# Altium schematic sheet sensorBoard.SchDoc: Valkyrie
size 508 x 381 mm; DrawnBy: Pedro Fernandes; Address1: Sensor Board; Address2: NFS Fenix; SheetNumber: 1; SheetTotal: 1
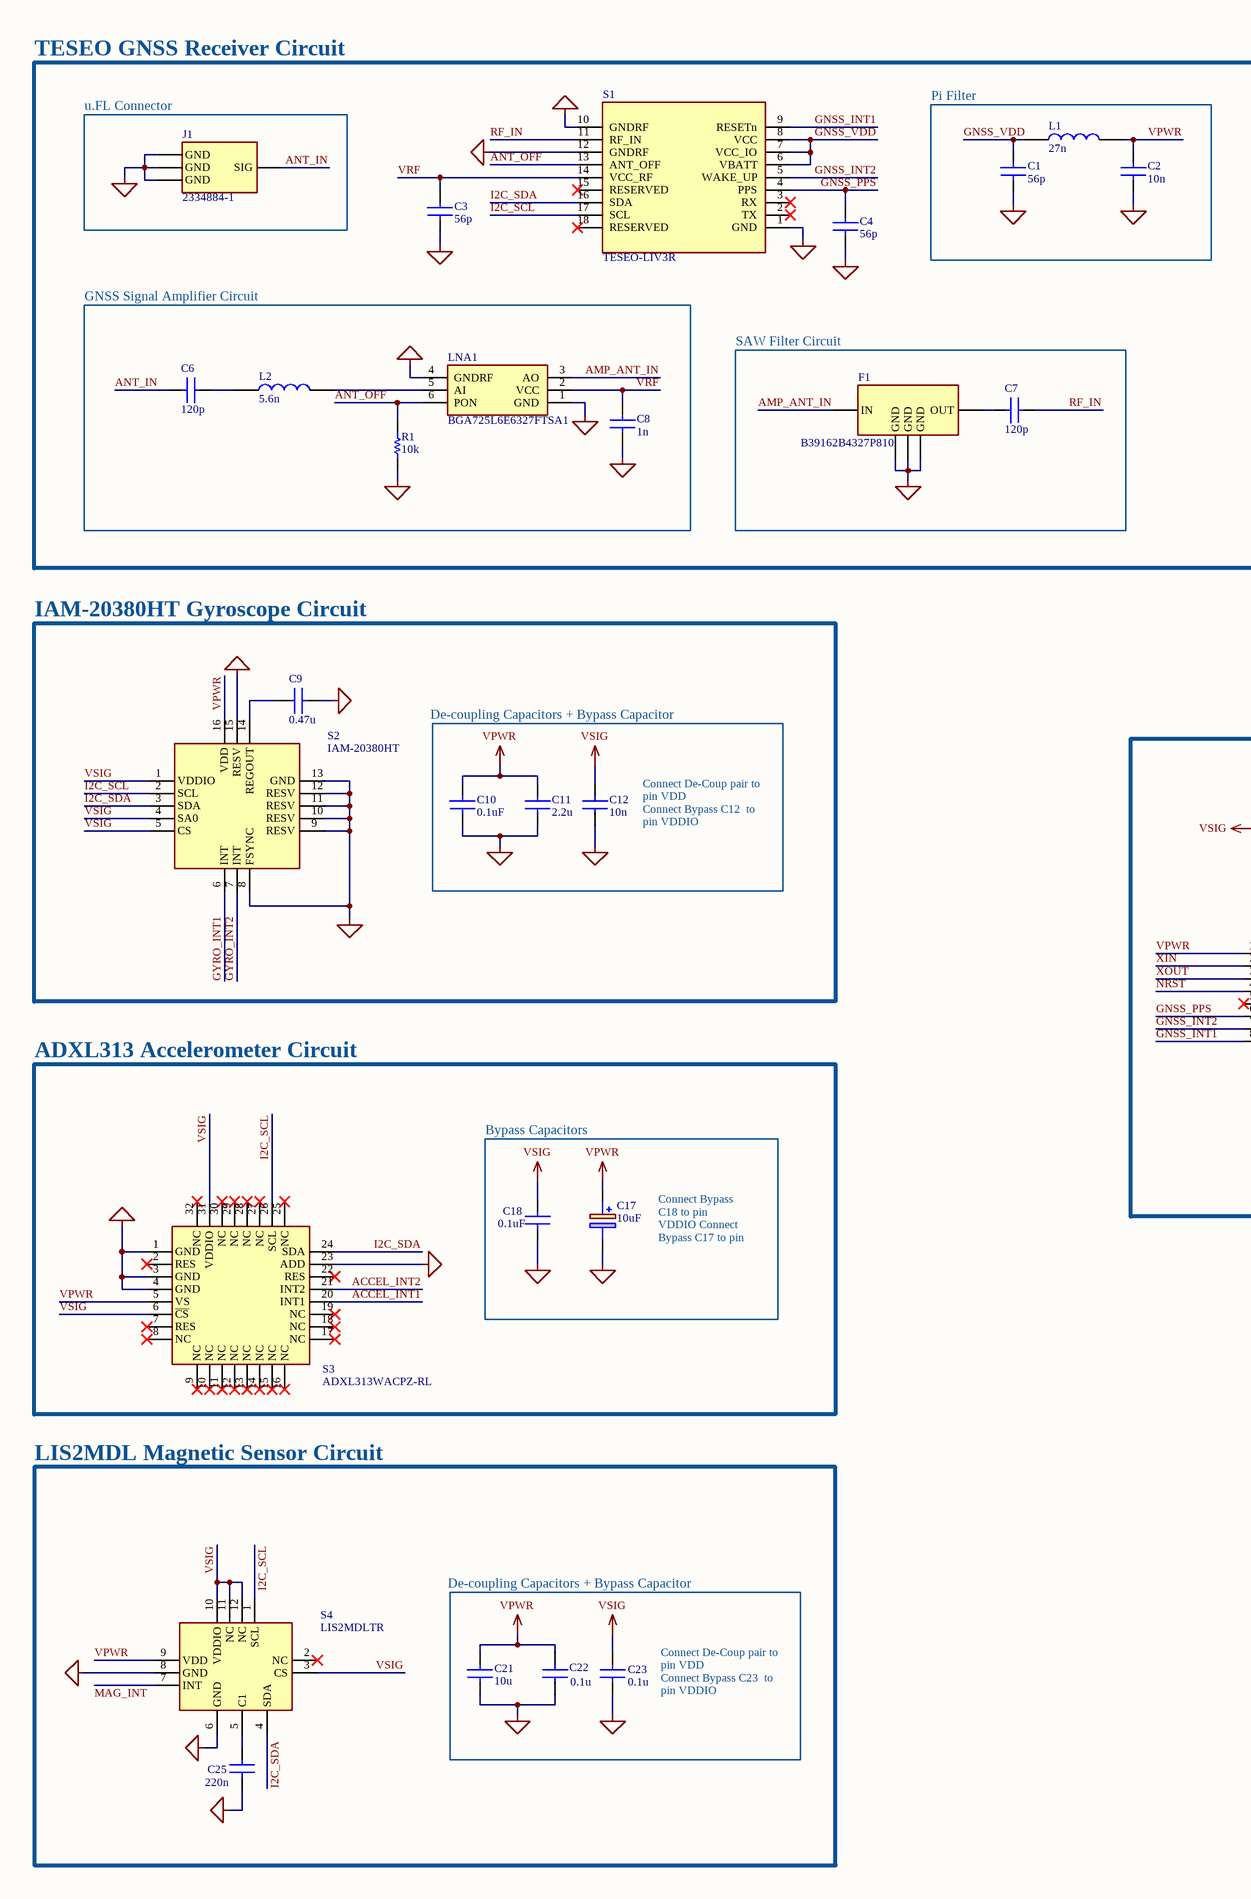
[diagram p0: sensorBoard.SchDoc, left]
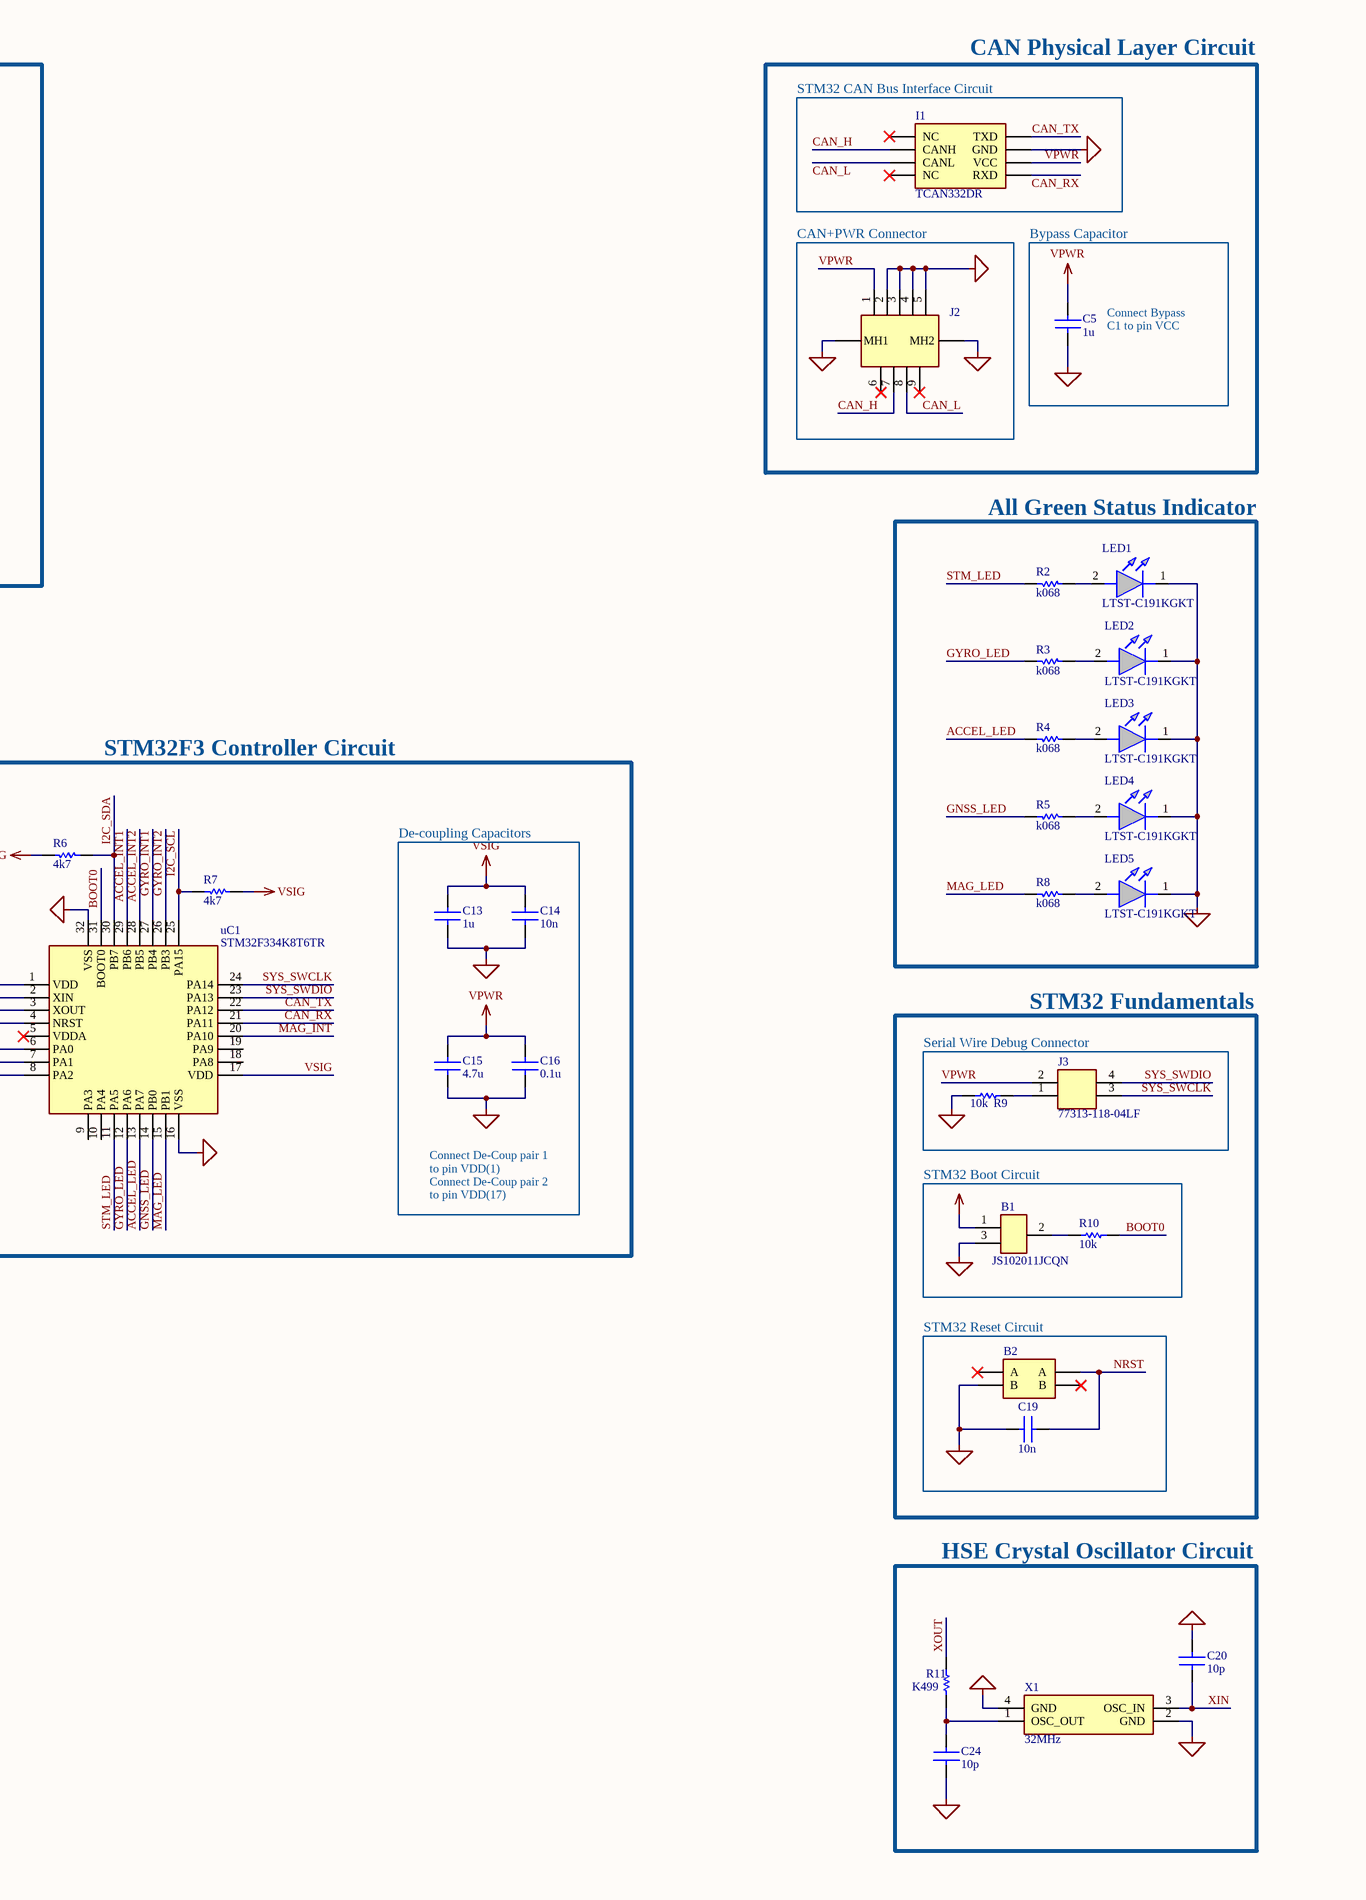
[diagram p1: sensorBoard.SchDoc, right]

## Parts
B1  JS102011JCQN  [JS102011JCQN]
B2  PTS810 SJM 250 SMTR LFS  [PTS810 SJM 250 SMTR LFS]  (value not drawn)
C1  56p  [GRM0335C1H560GA01D]
C2  10n  [MURATA CAP]
C3  56p  [GRM0335C1H560GA01D]
C4  56p  [GRM0335C1H560GA01D]
C5  1u  [MURATA CAP]
C6  120p  [MURATA CAP]
C7  120p  [MURATA CAP]
C8  1n  [MURATA CAP]
C9  0.47u  [GRM188R71E474KA12J]
C10  0.1uF  [CL03A104KQ3NNNC]
C11  2.2u  [GCM188R70J225KE22D]
C12  10n  [GRM033R70J103KA01D]
C13  1u  [MURATA CAP]
C14  10n  [GRM033R70J103KA01D]
C15  4.7u  [MURATA CAP]
C16  0.1u  [CL03A104KQ3NNNC]
C17  10uF  [293D106X96R3A2TE3]
C18  0.1uF  [CL03A104KQ3NNNC]
C19  10n  [GRM033R70J103KA01D]
C20  10p  [06036A100FAT2A]
C21  10u  [CL21A106KOQNNNE]
C22  0.1u  [CL03A104KQ3NNNC]
C23  0.1u  [CL03A104KQ3NNNC]
C24  10p  [06036A100FAT2A]
C25  220n  [GRM155R60J224KE01J]
F1  B39162B4327P810  [B39162B4327P810]
I1  TCAN332DR  [TCAN332DR]
J1  2334884-1  [2334884-1]
J2  LD09P33E4GV00LF  [LD09P33E4GV00LF]  (value not drawn)
J3  77313-118-04LF  [77313-118-04LF]
L1  27n  [LQG15HS27NJ02D]
L2  5.6n  [LQW15AN5N6G80D]
LED1  LTST-C191KGKT  [LTST-C191KGKT]
LED2  LTST-C191KGKT  [LTST-C191KGKT]
LED3  LTST-C191KGKT  [LTST-C191KGKT]
LED4  LTST-C191KGKT  [LTST-C191KGKT]
LED5  LTST-C191KGKT  [LTST-C191KGKT]
LNA1  BGA725L6E6327FTSA1  [BGA725L6E6327FTSA1]
R1  10k  [YAGEO Resistor]
R2  k068  [YAGEO Resistor]
R3  k068  [YAGEO Resistor]
R4  k068  [YAGEO Resistor]
R5  k068  [YAGEO Resistor]
R6  4k7  [YAGEO Resistor]
R7  4k7  [YAGEO Resistor]
R8  k068  [YAGEO Resistor]
R9  10k  [YAGEO Resistor]
R10  10k  [YAGEO Resistor]
R11  K499  [YAGEO Resistor]
S1  TESEO-LIV3R  [TESEO-LIV3R]
S2  IAM-20380HT  [IAM-20380HT]
S3  ADXL313WACPZ-RL  [ADXL313WACPZ-RL]
S4  LIS2MDLTR  [LIS2MDLTR]
uC1  STM32F334K8T6TR  [STM32F334K8T6TR]
X1  32MHz  [FA-128 32.0000MF20X-K5]

## Nets
GND: B1.3 B2.3(B) C1.1 C2.1 C3.1 C4.1 C5.1 C8.1 C9.2 C10.1 C11.1 C12.1 C13.1 C14.1 C15.1 C16.1 C17.2(-) C18.1 C19.1 C20.2 C21.1 C22.1 C23.1 C24.2 C25.1 F1.2(GND) F1.3(GND) F1.5(GND) I1.2(GND) J1.2(GND) J1.3(GND) J1.4(GND) J2.2 J2.3 J2.4 J2.5 J2.MH1 J2.MH2 LED1.1(K) LED2.1(K) LED3.1(K) LED4.1(K) LED5.1(K) LNA1.1(GND) LNA1.4(GNDRF) R1.2 R9.2 S1.1(GND) S1.10(GNDRF) S1.12(GNDRF) S2.8(FSYNC) S2.9(RESV) S2.10(RESV) S2.11(RESV) S2.12(RESV) S2.13(GND) S2.15(RESV) S3.1(GND) S3.3(GND) S3.4(GND) S3.23(ADD) S4.6(GND) S4.8(GND) uC1.16(VSS) uC1.32(VSS) X1.2(GND) X1.4(GND)
VPWR: C2.2 C5.2 C10.2 C11.2 C15.2 C16.2 C17.1(+) C21.2 C22.2 I1.3(VCC) J2.1 J3.2 L1.2 S2.16(VDD) S3.5(VS) S4.9(VDD) uC1.1(VDD)
VSIG: B1.1 C12.2 C13.2 C14.2 C18.2 C23.2 R6.2 R7.2 S2.1(VDDIO) S2.4(SA0) S2.5(CS) S3.6(~{CS}) S3.31(VDDIO) S4.3(CS) S4.10(VDDIO) S4.11(NC) S4.12(NC) uC1.17(VDD)
ACCEL_INT1: S3.20(INT1) uC1.29(PB6)
ACCEL_INT2: S3.21(INT2) uC1.28(PB5)
ACCEL_LED: R4.2 uC1.13(PA7)
AMP_ANT_IN: F1.1(IN) LNA1.3(AO)
ANT_IN: C6.1 J1.1(SIG)
ANT_OFF: LNA1.6(PON) R1.2 S1.13(ANT_OFF)
BOOT0: R10.2 uC1.31(BOOT0)
CAN_H: I1.7(CANH) J2.7
CAN_L: I1.6(CANL) J2.8
CAN_RX: I1.4(RXD) uC1.21(PA11)
CAN_TX: I1.1(TXD) uC1.22(PA12)
GNSS_INT1: S1.9(RESETn) uC1.8(PA2)
GNSS_INT2: S1.5(WAKE_UP) uC1.7(PA1)
GNSS_LED: R5.2 uC1.14(PB0)
GNSS_PPS: C4.2 S1.4(PPS) uC1.6(PA0)
GNSS_VDD: C1.2 L1.1 S1.6(VBATT) S1.7(VCC_IO) S1.8(VCC)
GYRO_INT1: S2.6(INT) uC1.27(PB4)
GYRO_INT2: S2.7(INT) uC1.26(PB3)
GYRO_LED: R3.2 uC1.12(PA6)
I2C_SCL: R7.2 S1.17(SCL) S2.2(SCL) S3.26(SCL) S4.1(SCL) uC1.25(PA15)
I2C_SDA: R6.2 S1.16(SDA) S2.3(SDA) S3.24(SDA) S4.4(SDA) uC1.30(PB7)
MAG_INT: S4.7(INT) uC1.20(PA10)
MAG_LED: R8.2 uC1.15(PB1)
NRST: B2.2(A) C19.2 uC1.4(NRST)
RF_IN: C7.1 S1.11(RF_IN)
STM_LED: R2.2 uC1.11(PA5)
SYS_SWCLK: J3.3 uC1.24(PA14)
SYS_SWDIO: J3.4 uC1.23(PA13)
VRF: C3.2 C8.2 LNA1.2(VCC) S1.14(VCC_RF)
XIN: C20.1 uC1.2(XIN) X1.3(OSC_IN)
XOUT: R11.2 uC1.3(XOUT)
NetB1_2: B1.2 R10.2
NetC6_2: C6.2 L2.1
NetC7_2: C7.2 F1.4(OUT)
NetC9_1: C9.1 S2.14(REGOUT)
NetC24_1: C24.1 R11.2 X1.1(OSC_OUT)
NetC25_2: C25.2 S4.5(C1)
NetJ3_1: J3.1 R9.2
NetL2_2: L2.2 LNA1.5(AI)
NetLED1_2: LED1.2(A) R2.2
NetLED2_2: LED2.2(A) R3.2
NetLED3_2: LED3.2(A) R4.2
NetLED4_2: LED4.2(A) R5.2
NetLED5_2: LED5.2(A) R8.2

Not connected (* = marked no-connect by the designer): B2 1(A)* 4(B)*; I1 5(NC)* 8(NC)*; J2 6* 9*; S1 2(TX)* 3(RX)* 15(RESERVED)* 18(RESERVED)*; S3 2(RES)* 7(RES)* 8(NC)* 9(NC)* 10(NC)* 11(NC)* 12(NC)* 13(NC)* 14(NC)* 15(NC)* 16(NC)* 17(NC)* 18(NC)* 19(NC)* 22(RES)* 25(NC)* 27(NC)* 28(NC)* 29(NC)* 30(NC)* 32(NC)*; S4 2(NC)*; uC1 5(VDDA)* 9(PA3) 10(PA4) 18(PA8) 19(PA9)

## Notes on the sheet
- TESEO GNSS Receiver Circuit
- (near I1) STM32 CAN Bus Interface Circuit
- CAN Physical Layer Circuit
- (near J1) u.FL Connector
- Pi Filter
- CAN+PWR Connector
- Bypass Capacitor
- GNSS Signal Amplifier Circuit
- SAW Filter Circuit
- (near C5) Connect Bypass C1 to pin VCC
- All Green Status Indicator
- IAM-20380HT Gyroscope Circuit
- De-coupling Capacitors + Bypass Capacitor
- STM32F3 Controller Circuit
- (near C12) Connect De-Coup pair to pin VDD                  Connect Bypass C12  to pin VDDIO
- De-coupling Capacitors
- STM32 Fundamentals
- Serial Wire Debug Connector
- ADXL313 Accelerometer Circuit
- Bypass Capacitors
- Connect De-Coup pair 1 to pin VDD(1)                  Connect De-Coup pair 2 to pin VDD(17)
- STM32 Boot Circuit
- Connect Bypass C18 to pin VDDIO Connect Bypass C17 to pin VS
- (near B2) STM32 Reset Circuit
- LIS2MDL Magnetic Sensor Circuit
- HSE Crystal Oscillator Circuit
- (near C23) Connect De-Coup pair to pin VDD                  Connect Bypass C23  to pin VDDIO
- Title
- Component Name
- Drawn By
- Revised By
- Project Name
- Sheet              of

## Library data of the parts
B1 = JS102011JCQN: Slide Switch SPDT Surface Mount
B2 = PTS810 SJM 250 SMTR LFS: Tactile Switch SPST-NO Top Actuated Surface Mount
C1 C3 C4 = GRM0335C1H560GA01D: 56 pF ±2% 50V Ceramic Capacitor C0G, NP0 0201 (0603 Metric)
C2 C6-C8 = MURATA CAP: Generic 0402 CAP
C5 C13 = MURATA CAP: 1 µF ±10% 6.3V Ceramic Capacitor X7R 0402 (1005 Metric)
C9 = GRM188R71E474KA12J: 0.47 µF ±10% 25V Ceramic Capacitor X7R 0603 (1608 Metric)
C10 C16 C18 C22 C23 = CL03A104KQ3NNNC: CAP CER 0.1UF 6.3V X5R 0201
C11 = GCM188R70J225KE22D: 2.2 µF ±10% 6.3V Ceramic Capacitor X7R 0603 (1608 Metric)
C12 C14 C19 = GRM033R70J103KA01D: 10000 pF ±10% 6.3V Ceramic Capacitor X7R 0201 (0603 Metric)
C15 = MURATA CAP: 4.7 µF ±20% 6.3V Ceramic Capacitor X5R 0402 (1005 Metric)
C17 = 293D106X96R3A2TE3: CAP TANT 10UF 10% 6.3V 1206
C20 C24 = 06036A100FAT2A: 10 pF ±1% 6.3V Ceramic Capacitor C0G, NP0 0603 (1608 Metric)
C21 = CL21A106KOQNNNE: 10 µF ±10% 16V Ceramic Capacitor X5R 0805 (2012 Metric)
C25 = GRM155R60J224KE01J: 0.22 µF ±10% 6.3V Ceramic Capacitor X5R 0402 (1005 Metric)
F1 = B39162B4327P810: Frequency RF SAW Filter (Surface Acoustic Wave) Bandwidth 5-SMD, No Lead
I1 = TCAN332DR: 1/1 Transceiver CANbus 8-SOIC
J1 = 2334884-1: U.FL (UMCC) Connector Receptacle, Male Pin 50 Ohms Surface Mount Solder
J2 = LD09P33E4GV00LF: 9 Position D-Sub Plug, Male Pins Connector
J3 = 77313-118-04LF: Connector Header Through Hole 4 position 0.100" (2.54mm)
L1 = LQG15HS27NJ02D: 27 nH Unshielded Multilayer Inductor 350 mA 460mOhm Max 0402 (1005 Metric)
L2 = LQW15AN5N6G80D: 5.6 nH Unshielded Drum Core, Wirewound Inductor 1.77 A 40mOhm Max 0402 (1005 Metric)
LED1-LED5 = LTST-C191KGKT: Green 571nm LED Indication - Discrete 2V 0603 (1608 Metric)
LNA1 = BGA725L6E6327FTSA1: RF Amplifier IC GPS/GNSS 1.55GHz ~ 1.615GHz TSLP-6-2
R1-R8 R11 = YAGEO Resistor: RES XK OHM 1% 1/16W 0402
R9 R10 = YAGEO Resistor: RES 10k OHM 1% 1/16W 0402
S1 = TESEO-LIV3R: RF Receiver BeiDou, GLONASS, GNSS, GPS 1.561GHz, 1.575MHz -163dBm Not Included 18-LCC (9.7x10.1)
S2 = IAM-20380HT: Gyroscope X (Pitch), Y (Roll), Z (Yaw) ±250, 500, 1000, 2000 5Hz ~ 250Hz I²C, SPI 16-LGA (3x3)
S3 = ADXL313WACPZ-RL: Accelerometer X, Y, Z Axis ±0.5g, 1g, 2g, 4g 3.125Hz ~ 1.6kHz 32-LFCSP-LQ (5x5)
S4 = LIS2MDLTR: Magnetoresistive Sensor X, Y, Z Axis 12-LGA (2x2)
uC1 = STM32F334K8T6TR: ARM® Cortex®-M4 STM32F3 Microcontroller IC 32-Bit Single-Core 72MHz 64KB (64K x 8) FLASH 32-LQFP (7x7)
X1 = FA-128 32.0000MF20X-K5: 32 MHz ±10ppm Crystal 10pF 60 Ohms 4-SMD, No Lead